# EAGLE schematic Pianissimo (EAGLE 9.2.1)
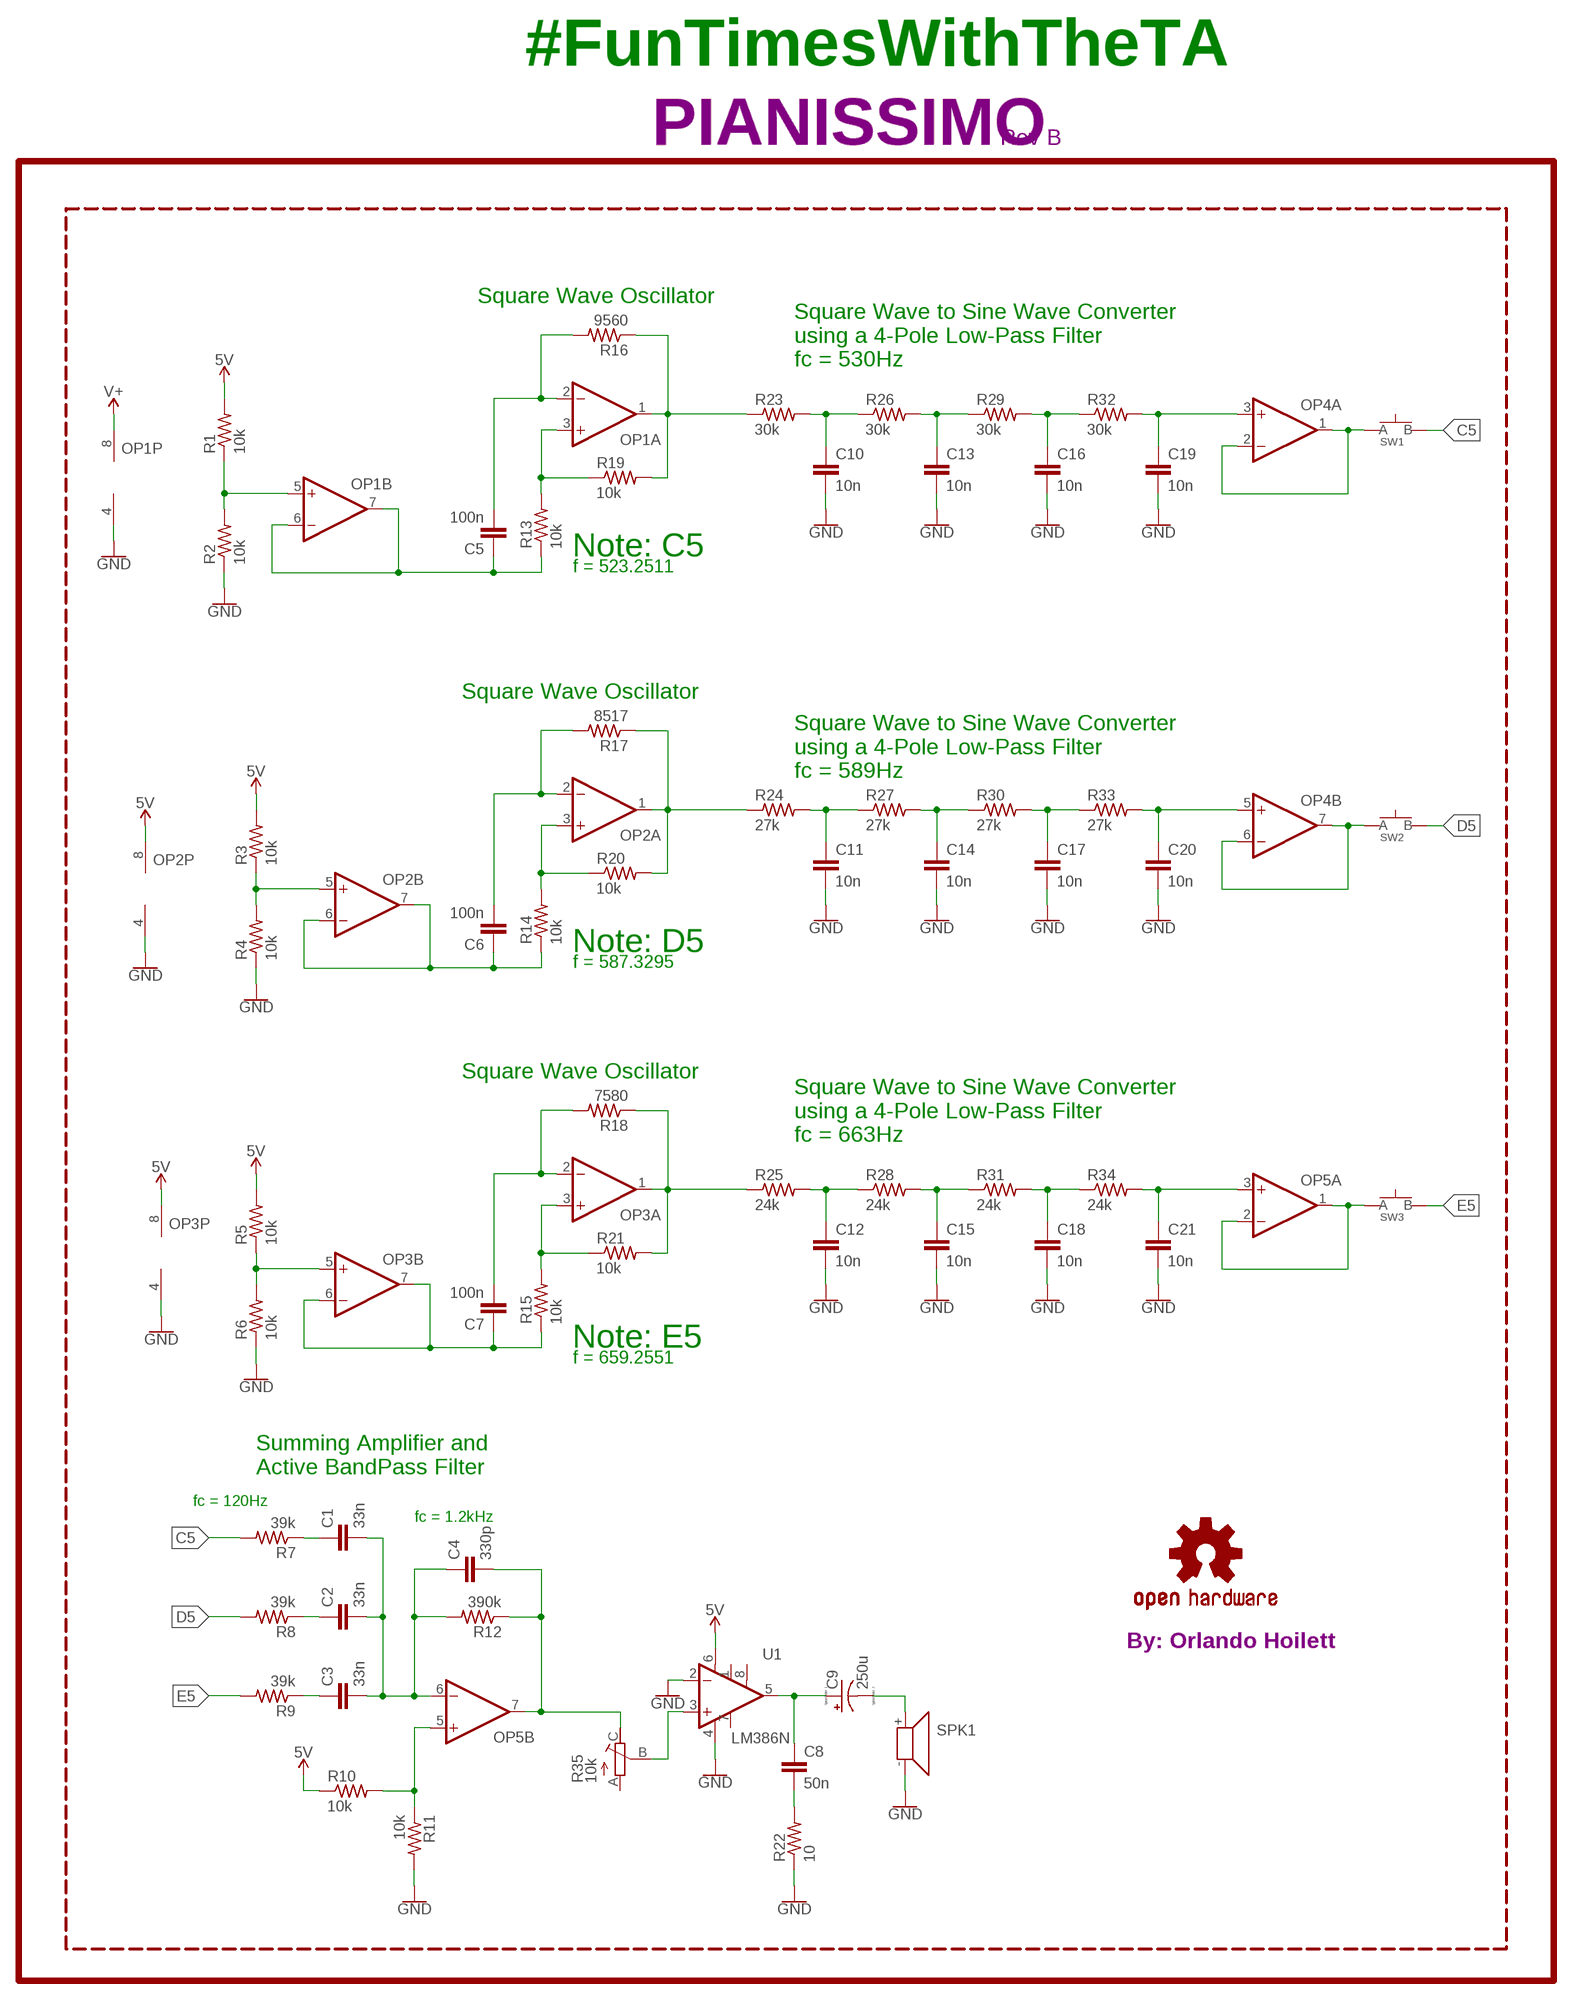
[diagram p0: schematic, sheet 1]

## Parts
C1  33n  CAPACITOR0402  [C0402]
C2  33n  CAPACITOR0402  [C0402]
C3  33n  CAPACITOR0402  [C0402]
C4  330p  CAPACITOR0402  [C0402]
C5  100n  CAPACITOR0402  [C0402]
C6  100n  CAPACITOR0402  [C0402]
C7  100n  CAPACITOR0402  [C0402]
C8  50n  CAPACITOR0603  [C0603]
C9  250u  CAPACITOR.POLARC-EEU-FM-A-220UF  [C-EEU-FM-A-220UF]
C10  10n  CAPACITOR0402  [C0402]
C11  10n  CAPACITOR0402  [C0402]
C12  10n  CAPACITOR0402  [C0402]
C13  10n  CAPACITOR0402  [C0402]
C14  10n  CAPACITOR0402  [C0402]
C15  10n  CAPACITOR0402  [C0402]
C16  10n  CAPACITOR0402  [C0402]
C17  10n  CAPACITOR0402  [C0402]
C18  10n  CAPACITOR0402  [C0402]
C19  10n  CAPACITOR0402  [C0402]
C20  10n  CAPACITOR0402  [C0402]
C21  10n  CAPACITOR0402  [C0402]
LOGO1  OSHW-LOGOL  [OSHW-LOGO-L]
OP1  OP-DUALR  [SO8]
OP2  OP-DUALR  [SO8]
OP3  OP-DUALR  [SO8]
OP4  OP-DUALR  [SO8]
OP5  OP-DUALR  [SO8]
R1  10k  RESISTOR0402-SMALLER  [R0402-SMALL]
R2  10k  RESISTOR0402-SMALLER  [R0402-SMALL]
R3  10k  RESISTOR0402-SMALLER  [R0402-SMALL]
R4  10k  RESISTOR0402-SMALLER  [R0402-SMALL]
R5  10k  RESISTOR0402-SMALLER  [R0402-SMALL]
R6  10k  RESISTOR0402-SMALLER  [R0402-SMALL]
R7  39k  RESISTOR0402-SMALLER  [R0402-SMALL]
R8  39k  RESISTOR0402-SMALLER  [R0402-SMALL]
R9  39k  RESISTOR0402-SMALLER  [R0402-SMALL]
R10  10k  RESISTOR0402-SMALLER  [R0402-SMALL]
R11  10k  RESISTOR0402-SMALLER  [R0402-SMALL]
R12  390k  RESISTOR0402-SMALLER  [R0402-SMALL]
R13  10k  RESISTOR0402-SMALLER  [R0402-SMALL]
R14  10k  RESISTOR0402-SMALLER  [R0402-SMALL]
R15  10k  RESISTOR0402-SMALLER  [R0402-SMALL]
R16  9560  RESISTOR0402-SMALLER  [R0402-SMALL]
R17  8517  RESISTOR0402-SMALLER  [R0402-SMALL]
R18  7580  RESISTOR0402-SMALLER  [R0402-SMALL]
R19  10k  RESISTOR0402-SMALLER  [R0402-SMALL]
R20  10k  RESISTOR0402-SMALLER  [R0402-SMALL]
R21  10k  RESISTOR0402-SMALLER  [R0402-SMALL]
R22  10  RESISTOR0603  [R0603]
R23  30k  RESISTOR0402-SMALLER  [R0402-SMALL]
R24  27k  RESISTOR0402-SMALLER  [R0402-SMALL]
R25  24k  RESISTOR0402-SMALLER  [R0402-SMALL]
R26  30k  RESISTOR0402-SMALLER  [R0402-SMALL]
R27  27k  RESISTOR0402-SMALLER  [R0402-SMALL]
R28  24k  RESISTOR0402-SMALLER  [R0402-SMALL]
R29  30k  RESISTOR0402-SMALLER  [R0402-SMALL]
R30  27k  RESISTOR0402-SMALLER  [R0402-SMALL]
R31  24k  RESISTOR0402-SMALLER  [R0402-SMALL]
R32  30k  RESISTOR0402-SMALLER  [R0402-SMALL]
R33  27k  RESISTOR0402-SMALLER  [R0402-SMALL]
R34  24k  RESISTOR0402-SMALLER  [R0402-SMALL]
R35  10k  R-TRIMM-CB10V  [RTRIMCB10]
REV1  REVISION.B  [REV.B]
SPK1  SPEAKER  [SOLDER.TABS]
SW1  SPST.KT11P4SM34LFS  [SPST.KT11P4SM34LFS]
SW2  SPST.KT11P4SM34LFS  [SPST.KT11P4SM34LFS]
SW3  SPST.KT11P4SM34LFS  [SPST.KT11P4SM34LFS]
U1  LM386N  LM386  [DIP08]

## Nets
5V: OP2.8(P:V+) OP3.8(P:V+) R1.2 R3.2 R5.2 R10.1 U1.6(V+)
C5: R7.2 SW1.3(B) SW1.4(B)
D5: R8.2 SW2.3(B) SW2.4(B)
E5: R9.2 SW3.3(B) SW3.4(B)
GND: C10.2 C11.2 C12.2 C13.2 C14.2 C15.2 C16.2 C17.2 C18.2 C19.2 C20.2 C21.2 OP1.4(P:V-) OP2.4(P:V-) OP3.4(P:V-) R2.1 R4.1 R6.1 R11.2 R22.1 SPK1.- U1.2(-IN) U1.4(V-)
N$1: OP2.1(A:OUT) R17.1 R20.2 R24.1
N$2: OP2.3(A:+IN) R14.2 R20.1
N$3: C6.2 OP2.2(A:-IN) R17.2
N$4: C11.1 R24.2 R27.1
N$5: C14.1 R27.2 R30.1
N$6: C17.1 R30.2 R33.1
N$7: C20.1 OP4.5(B:+IN) R33.2
N$8: OP5.5(B:+IN) R10.2 R11.1
N$9: C1.1 R7.1
N$10: C2.1 R8.1
N$11: OP4.1(A:OUT) OP4.2(A:-IN) SW1.1(A) SW1.2(A)
N$12: R35.B(S) U1.3(+IN)
N$13: C5.1 OP1.6(B:-IN) OP1.7(B:OUT) R13.1
N$14: OP5.1(A:OUT) OP5.2(A:-IN) SW3.1(A) SW3.2(A)
N$16: OP4.6(B:-IN) OP4.7(B:OUT) SW2.1(A) SW2.2(A)
N$17: C6.1 OP2.6(B:-IN) OP2.7(B:OUT) R14.1
N$19: C7.1 OP3.6(B:-IN) OP3.7(B:OUT) R15.1
N$21: OP1.5(B:+IN) R1.1 R2.2
N$22: OP3.1(A:OUT) R18.1 R21.2 R25.1
N$23: OP3.3(A:+IN) R15.2 R21.1
N$24: C7.2 OP3.2(A:-IN) R18.2
N$25: C12.1 R25.2 R28.1
N$26: C15.1 R28.2 R31.1
N$27: C18.1 R31.2 R34.1
N$28: C21.1 OP5.3(A:+IN) R34.2
N$29: OP2.5(B:+IN) R3.1 R4.2
N$30: OP3.5(B:+IN) R5.1 R6.2
N$38: OP1.1(A:OUT) R16.1 R19.2 R23.1
N$39: OP1.3(A:+IN) R13.2 R19.1
N$40: C5.2 OP1.2(A:-IN) R16.2
N$41: C10.1 R23.2 R26.1
N$42: C13.1 R26.2 R29.1
N$43: C16.1 R29.2 R32.1
N$44: C19.1 OP4.3(A:+IN) R32.2
N$50: C3.1 R9.1
N$51: C1.2 C2.2 C3.2 C4.1 OP5.6(B:-IN) R12.2
N$55: C4.2 OP5.7(B:OUT) R12.1 R35.C(E)
N$56: C8.1 C9.+ U1.5(OUT)
N$57: C9.- SPK1.+
N$58: C8.2 R22.2
V+: OP1.8(P:V+)
Unconnected: R35.A U1.1(GAIN) U1.7(BP) U1.8(GAIN)

## Notes on the sheet
- #FunTimesWithTheTA
- PIANISSIMO
- Square Wave Oscillator
- Square Wave to Sine Wave Converter
  using a 4-Pole Low-Pass Filter
  fc = 530Hz
- Note: C5
- f = 523.2511
- Square Wave Oscillator
- Square Wave to Sine Wave Converter
  using a 4-Pole Low-Pass Filter
  fc = 589Hz
- Note: D5
- f = 587.3295
- Square Wave Oscillator
- Square Wave to Sine Wave Converter
  using a 4-Pole Low-Pass Filter
  fc = 663Hz
- Note: E5
- f = 659.2551
- Summing Amplifier and
  Active BandPass Filter
- fc = 120Hz
- fc = 1.2kHz
- By: Orlando Hoilett

## Power pins joined to a net without a drawn wire
V+: OP4.8(P:V+) OP5.8(P:V+)
V-: OP4.4(P:V-) OP5.4(P:V-)

## Library data of the parts
C1-C8 C10-C21 = CalvEngIO-Passives:CAPACITOR
C9 = CalvEngIO-Passives:CAPACITOR.POLAR
LOGO1 = CalvEngIO-Logos:OSHW-LOGO: Open-Source Hardware (OSHW) Logo This logo indicates the piece of hardware it is found on incorporates a OSHW license and/or adheres to the definition of open source hardware found here: http://freedomdefined.org/OSHW
OP1-OP5 = CalvEngIO-AnalogIC:OP-DUAL: Precision Micropower, Low Noise CMOS, Rail-to-Rail Input/Output Operational Amplifiers Source: http://www.analog.com/static/imported-files/data_sheets/AD8603_8607_8609.pdf; MPN: AD8607ARMZ-R2; OC_FARNELL: 1651293; OC_NEWARK: 19M8927
R1-R34 = CalvEngIO-Passives:RESISTOR
R35 = CalvEngIO-Passives:R-TRIMM: Trimm resistor
REV1 = CalvEngIO-Symbols:REVISION.B
SPK1 = CalvEngIO-Electromechanical:SPEAKER
SW1-SW3 = CalvEngIO-Switches:SPST.KT11P4SM34LFS: https://www.ckswitches.com/media/1468/kt.pdf
U1 = SparkFun-IC-Amplifiers:LM386: low voltage audio power amplifier SparkFun Products FabFM Radio Kit <https://www.sparkfun.com/products/11043> (KIT-11043); PROD_ID: IC-10899